# Altium schematic sheet 01.Index and Notes.SchDoc
size 420 x 297 mm; Revision: V2.1; Schematic Page Number: 11; Page Number: 2; Check: Default; Schematic Name: RK_NVR_DEMO1_RK3588_LP4/4x_V21; Page Count: 43; Page name: 01.Index and Notes; Designer: Zhangdz; Schematic Page Count: 99; Revcode: V2.1; DsnPath: E:\Work\SBER\RK3588_SOM\temp\RK_NVR_DEMO1_RK3588_LP4XD200P232SD8_V21_20211228.DSN; SchematicName: RK_NVR_DEMO1_RK3588_LP4/4x_V21; PageName: 01.Index and Notes; PageSize: A3; TopSchematic: True
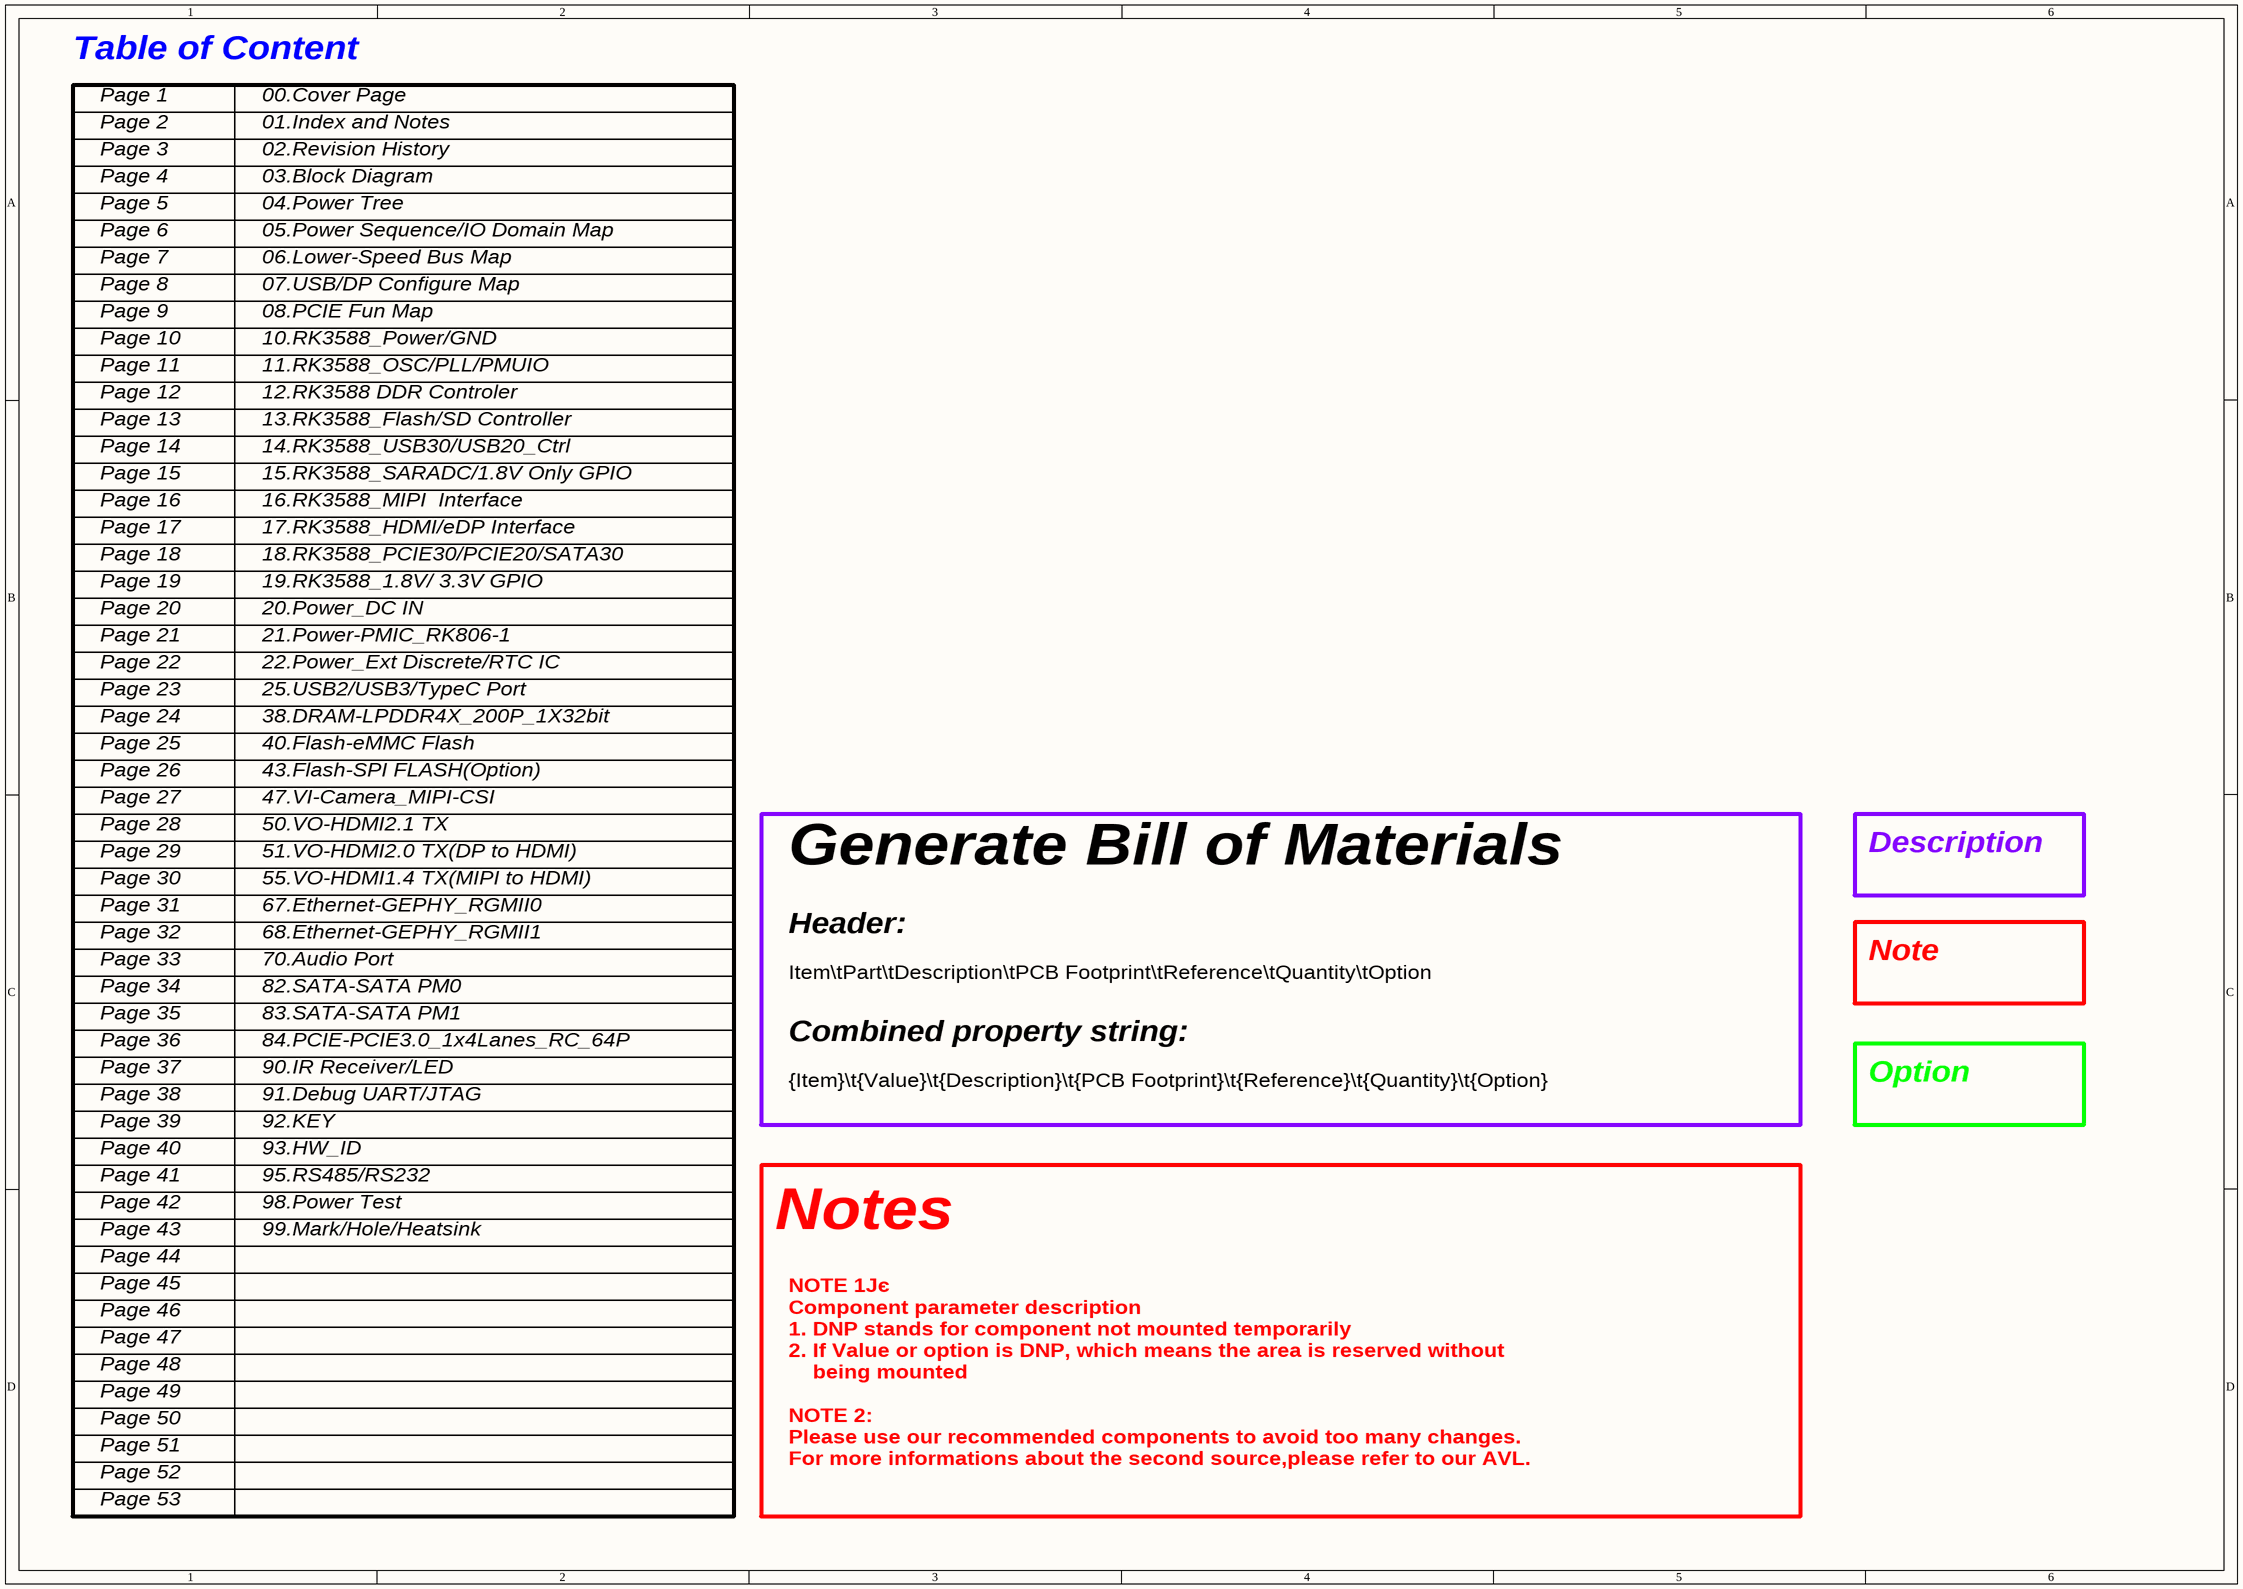
[diagram p0: 01.Index and Notes.SchDoc]

## Notes on the sheet
- Table of Content
- Page 1
- 00.Cover Page
- Page 2
- Page 3
- Page 4
- 01.Index and Notes
- 02.Revision History
- 03.Block Diagram
- Page 5
- Page 6
- 04.Power Tree
- 05.Power Sequence/IO Domain Map
- Page 7
- Page 8
- Page 9
- 06.Lower-Speed Bus Map
- 07.USB/DP Configure Map
- 08.PCIE Fun Map
- Page 10
- Page 11
- 10.RK3588_Power/GND
- 11.RK3588_OSC/PLL/PMUIO
- Page 12
- Page 13
- Page 14
- 13.RK3588_Flash/SD Controller
- 12.RK3588 DDR Controler
- 14.RK3588_USB30/USB20_Ctrl
- Page 15
- Page 16
- 15.RK3588_SARADC/1.8V Only GPIO
- 16.RK3588_MIPI  Interface
- Page 17
- Page 18
- Page 19
- 17.RK3588_HDMI/eDP Interface
- 18.RK3588_PCIE30/PCIE20/SATA30
- 19.RK3588_1.8V/ 3.3V GPIO
- Page 20
- Page 21
- 20.Power_DC IN
- 21.Power-PMIC_RK806-1
- Page 22
- Page 23
- Page 24
- 25.USB2/USB3/TypeC Port
- 38.DRAM-LPDDR4X_200P_1X32bit
- 22.Power_Ext Discrete/RTC IC
- Page 25
- Page 26
- 40.Flash-eMMC Flash
- 43.Flash-SPI FLASH(Option)
- Page 27
- Page 28
- Page 29
- 47.VI-Camera_MIPI-CSI
- 50.VO-HDMI2.1 TX
- 51.VO-HDMI2.0 TX(DP to HDMI)
- Description
- Page 30
- Page 31
- 55.VO-HDMI1.4 TX(MIPI to HDMI)
- 67.Ethernet-GEPHY_RGMII0
- Header:
- Generate Bill of Materials
- Page 32
- Page 33
- Page 34
- 70.Audio Port
- 68.Ethernet-GEPHY_RGMII1
- 82.SATA-SATA PM0
- Item\tPart\tDescription\tPCB Footprint\tReference\tQuantity\tOption
- Note
- Page 35
- Page 36
- 83.SATA-SATA PM1
- 84.PCIE-PCIE3.0_1x4Lanes_RC_64P
- Combined property string:
- Page 37
- Page 38
- Page 39
- 90.IR Receiver/LED
- 91.Debug UART/JTAG
- 92.KEY
- {Item}\t{Value}\t{Description}\t{PCB Footprint}\t{Reference}\t{Quantity}\t{Option}
- Option
- Page 40
- Page 41
- 95.RS485/RS232
- 93.HW_ID
- Page 42
- Page 43
- Page 44
- 99.Mark/Hole/Heatsink
- 98.Power Test
- Notes
- Page 45
- Page 46
- Page 47
- Page 48
- Page 49
- Page 50
- Page 51
- NOTE 1Јє
  Component parameter description
  1. DNP stands for component not mounted temporarily
  2. If Value or option is DNP, which means the area is reserved without
  being mounted
  NOTE 2:
  Please use our recommended components to avoid too many changes.
  For more informations about the second source,please refer to our AVL.
- Page 52
- Page 53